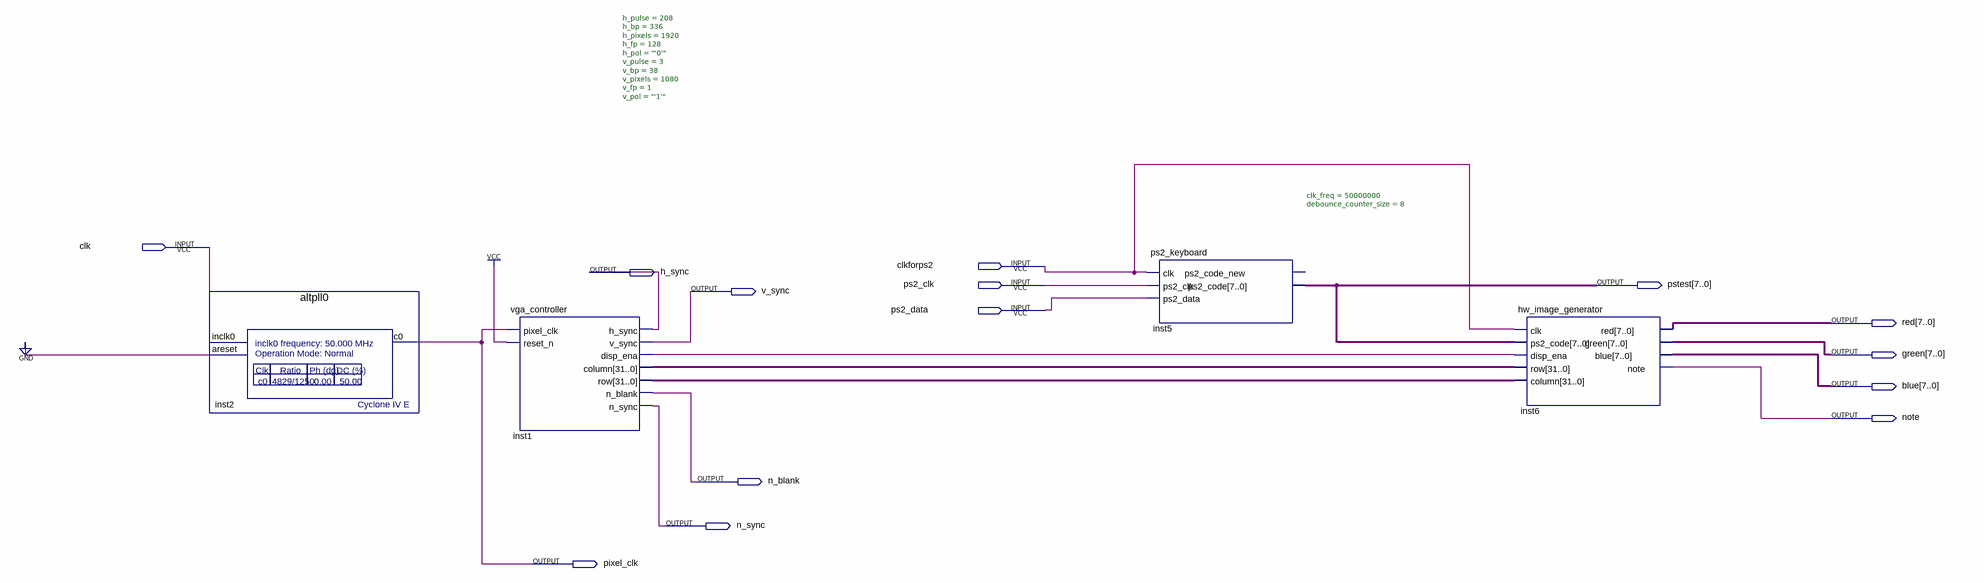
[diagram p0: schematic sheet]
// Quartus schematic vga_with_hw_test_image.bdf as structural Verilog: 4 symbols, 14 pins
module vga_with_hw_test_image (
  input  clk,
  input  clkforps2,
  input  ps2_clk,
  input  ps2_data,
  output h_sync,
  output [7:0] pstest,
  output v_sync,
  output [7:0] red,
  output [7:0] green,
  output [7:0] blue,
  output note,
  output n_blank,
  output n_sync,
  output pixel_clk
);

  wire inst1_disp_ena;
  wire [31:0] inst1_column, inst1_row;

  altpll0 inst2 (.inclk0(clk), .areset(1'b0), .c0(pixel_clk));
  vga_controller #(.h_pulse(208), .h_bp(336), .h_pixels(1920), .h_fp(128), .h_pol("'0'"), .v_pulse(3), .v_bp(38), .v_pixels(1080), .v_fp(1), .v_pol("'1'")) inst1 (
    .pixel_clk(pixel_clk), .reset_n(1'b1), .h_sync(h_sync), .v_sync(v_sync), .disp_ena(inst1_disp_ena),
    .column(inst1_column), .row(inst1_row), .n_blank(n_blank), .n_sync(n_sync));
  ps2_keyboard #(.clk_freq(50000000), .debounce_counter_size(8)) inst5 (
    .clk(clkforps2), .ps2_clk(ps2_clk), .ps2_data(ps2_data), .ps2_code(pstest));  // open: ps2_code_new
  hw_image_generator inst6 (
    .clk(clkforps2), .ps2_code(pstest), .disp_ena(inst1_disp_ena), .row(inst1_column), .column(inst1_row),
    .red(red), .green(green), .blue(blue), .note(note));
endmodule
